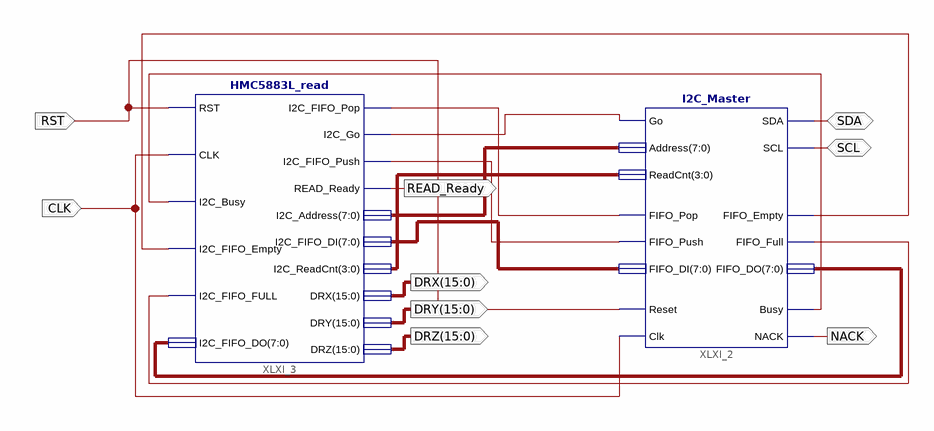
[diagram p0: schematic sheet 1]
// Xilinx ISE schematic Magnetometr.sch (spartan3e) as structural Verilog: 2 symbols, 9 ports
module Magnetometr (
  input  CLK,
  input  RST,
  inout  SDA,
  inout  SCL,
  output NACK,
  output [15:0] DRX,
  output [15:0] DRY,
  output [15:0] DRZ,
  output READ_Ready
);

  wire XLXN_62, XLXN_77, XLXN_78, XLXN_80, XLXN_117, XLXN_119;
  wire [3:0] XLXN_67;
  wire [7:0] XLXN_63, XLXN_68, XLXN_70;

  I2C_Master XLXI_2 (
    .Go(XLXN_78), .Address(XLXN_68), .ReadCnt(XLXN_67), .SDA(SDA), .SCL(SCL), .FIFO_Pop(XLXN_80),
    .FIFO_Push(XLXN_77), .FIFO_DI(XLXN_70), .FIFO_Empty(XLXN_117), .FIFO_Full(XLXN_119), .FIFO_DO(XLXN_63),
    .Reset(RST), .Clk(CLK), .Busy(XLXN_62), .NACK(NACK));
  HMC5883L_read XLXI_3 (
    .RST(RST), .CLK(CLK), .I2C_Busy(XLXN_62), .I2C_FIFO_Empty(XLXN_117), .I2C_FIFO_FULL(XLXN_119),
    .I2C_FIFO_DO(XLXN_63), .I2C_FIFO_Pop(XLXN_80), .I2C_Go(XLXN_78), .I2C_FIFO_Push(XLXN_77),
    .READ_Ready(READ_Ready), .I2C_Address(XLXN_68), .I2C_FIFO_DI(XLXN_70), .I2C_ReadCnt(XLXN_67), .DRX(DRX),
    .DRY(DRY), .DRZ(DRZ));
endmodule
